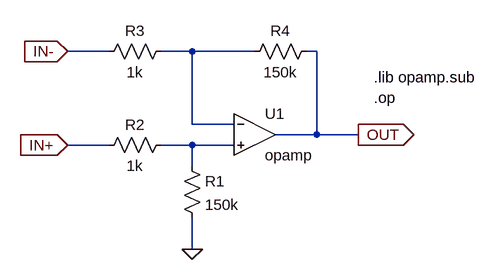
[diagram p0: schematic myAmplifier.asc]
myAmplifier.asc, the LTspice schematic file:
Version 4
SHEET 1 1228 680
WIRE 144 208 80 208
WIRE 272 208 224 208
WIRE 368 208 272 208
WIRE 464 208 448 208
WIRE 272 320 272 208
WIRE 336 320 272 320
WIRE 464 336 464 208
WIRE 464 336 400 336
WIRE 528 336 464 336
WIRE 144 352 80 352
WIRE 272 352 224 352
WIRE 336 352 272 352
WIRE 272 384 272 352
WIRE 272 512 272 464
FLAG 272 512 0
FLAG 80 208 IN-
IOPIN 80 208 In
FLAG 528 336 OUT
IOPIN 528 336 Out
FLAG 80 352 IN+
IOPIN 80 352 In
SYMBOL Opamps/opamp 368 272 R0
SYMATTR InstName U1
SYMBOL res 256 368 R0
SYMATTR InstName R1
SYMATTR Value 150k
SYMBOL res 240 336 R90
WINDOW 0 0 56 VBottom 2
WINDOW 3 32 56 VTop 2
SYMATTR InstName R2
SYMATTR Value 1k
SYMBOL res 240 192 R90
WINDOW 0 0 56 VBottom 2
WINDOW 3 32 56 VTop 2
SYMATTR InstName R3
SYMATTR Value 1k
SYMBOL res 464 192 R90
WINDOW 0 0 56 VBottom 2
WINDOW 3 32 56 VTop 2
SYMATTR InstName R4
SYMATTR Value 150k
TEXT 552 248 Left 2 !.lib opamp.sub\n.op

The netlist it stands for:
* myAmplifier.asc
XU1 N001 N002 OUT opamp Aol=100K GBW=10Meg  ; pins invin noninvin out
R1 N002 0 150k
R2 N002 IN+ 1k
R3 N001 IN- 1k
R4 OUT N001 150k
.lib opamp.sub
.op
.backanno
.end